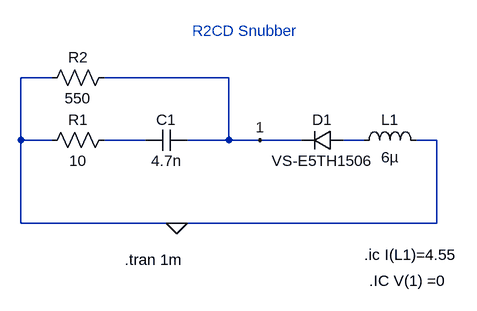
[diagram p0: schematic R2CD.asc]
R2CD.asc, the LTspice schematic file:
Version 4
SHEET 1 880 680
WIRE -96 96 -144 96
WIRE 176 96 -16 96
WIRE -144 192 -144 96
WIRE -96 192 -144 192
WIRE 48 192 -16 192
WIRE 176 192 176 96
WIRE 176 192 112 192
WIRE 224 192 176 192
WIRE 288 192 224 192
WIRE 384 192 352 192
WIRE 496 192 464 192
WIRE -144 320 -144 192
WIRE 96 320 -144 320
WIRE 496 320 496 192
WIRE 496 320 96 320
FLAG 96 320 0
FLAG 224 192 1
SYMBOL ind 368 208 R270
WINDOW 0 32 56 VTop 2
WINDOW 3 5 56 VBottom 2
SYMATTR InstName L1
SYMATTR Value 6µ
SYMATTR SpiceLine Rser=0
SYMBOL cap 112 176 R90
WINDOW 0 0 32 VBottom 2
WINDOW 3 32 32 VTop 2
SYMATTR InstName C1
SYMATTR Value 4.7n
SYMBOL res 0 176 R90
WINDOW 0 0 56 VBottom 2
WINDOW 3 32 56 VTop 2
SYMATTR InstName R1
SYMATTR Value 10
SYMBOL res 0 80 R90
WINDOW 0 0 56 VBottom 2
WINDOW 3 32 56 VTop 2
SYMATTR InstName R2
SYMATTR Value 550
SYMBOL diode 352 176 R90
WINDOW 0 0 32 VBottom 2
WINDOW 3 32 32 VTop 2
SYMATTR InstName D1
SYMATTR Value VS-E5TH1506
TEXT 16 376 Left 2 !.tran 1m
TEXT 384 368 Left 2 !.ic I(L1)=4.55
TEXT 392 408 Left 2 !.IC V(1) =0
TEXT 120 24 Left 2 ;R2CD Snubber

The netlist it stands for:
* R2CD.asc
L1 N002 0 6µ Rser=0
C1 1 N001 4.7n
R1 N001 0 10
R2 1 0 550
D1 N002 1 VS-E5TH1506
.model D D
.lib standard.dio
.tran 1m
.ic I(L1)=4.55
.IC V(1) =0
* R2CD Snubber
.backanno
.end